# Altium schematic sheet ADC Board TOP.SchDoc
size A3; Author: Jean Callus; Organization: RATON; Revision: 0; SheetNumber: 1
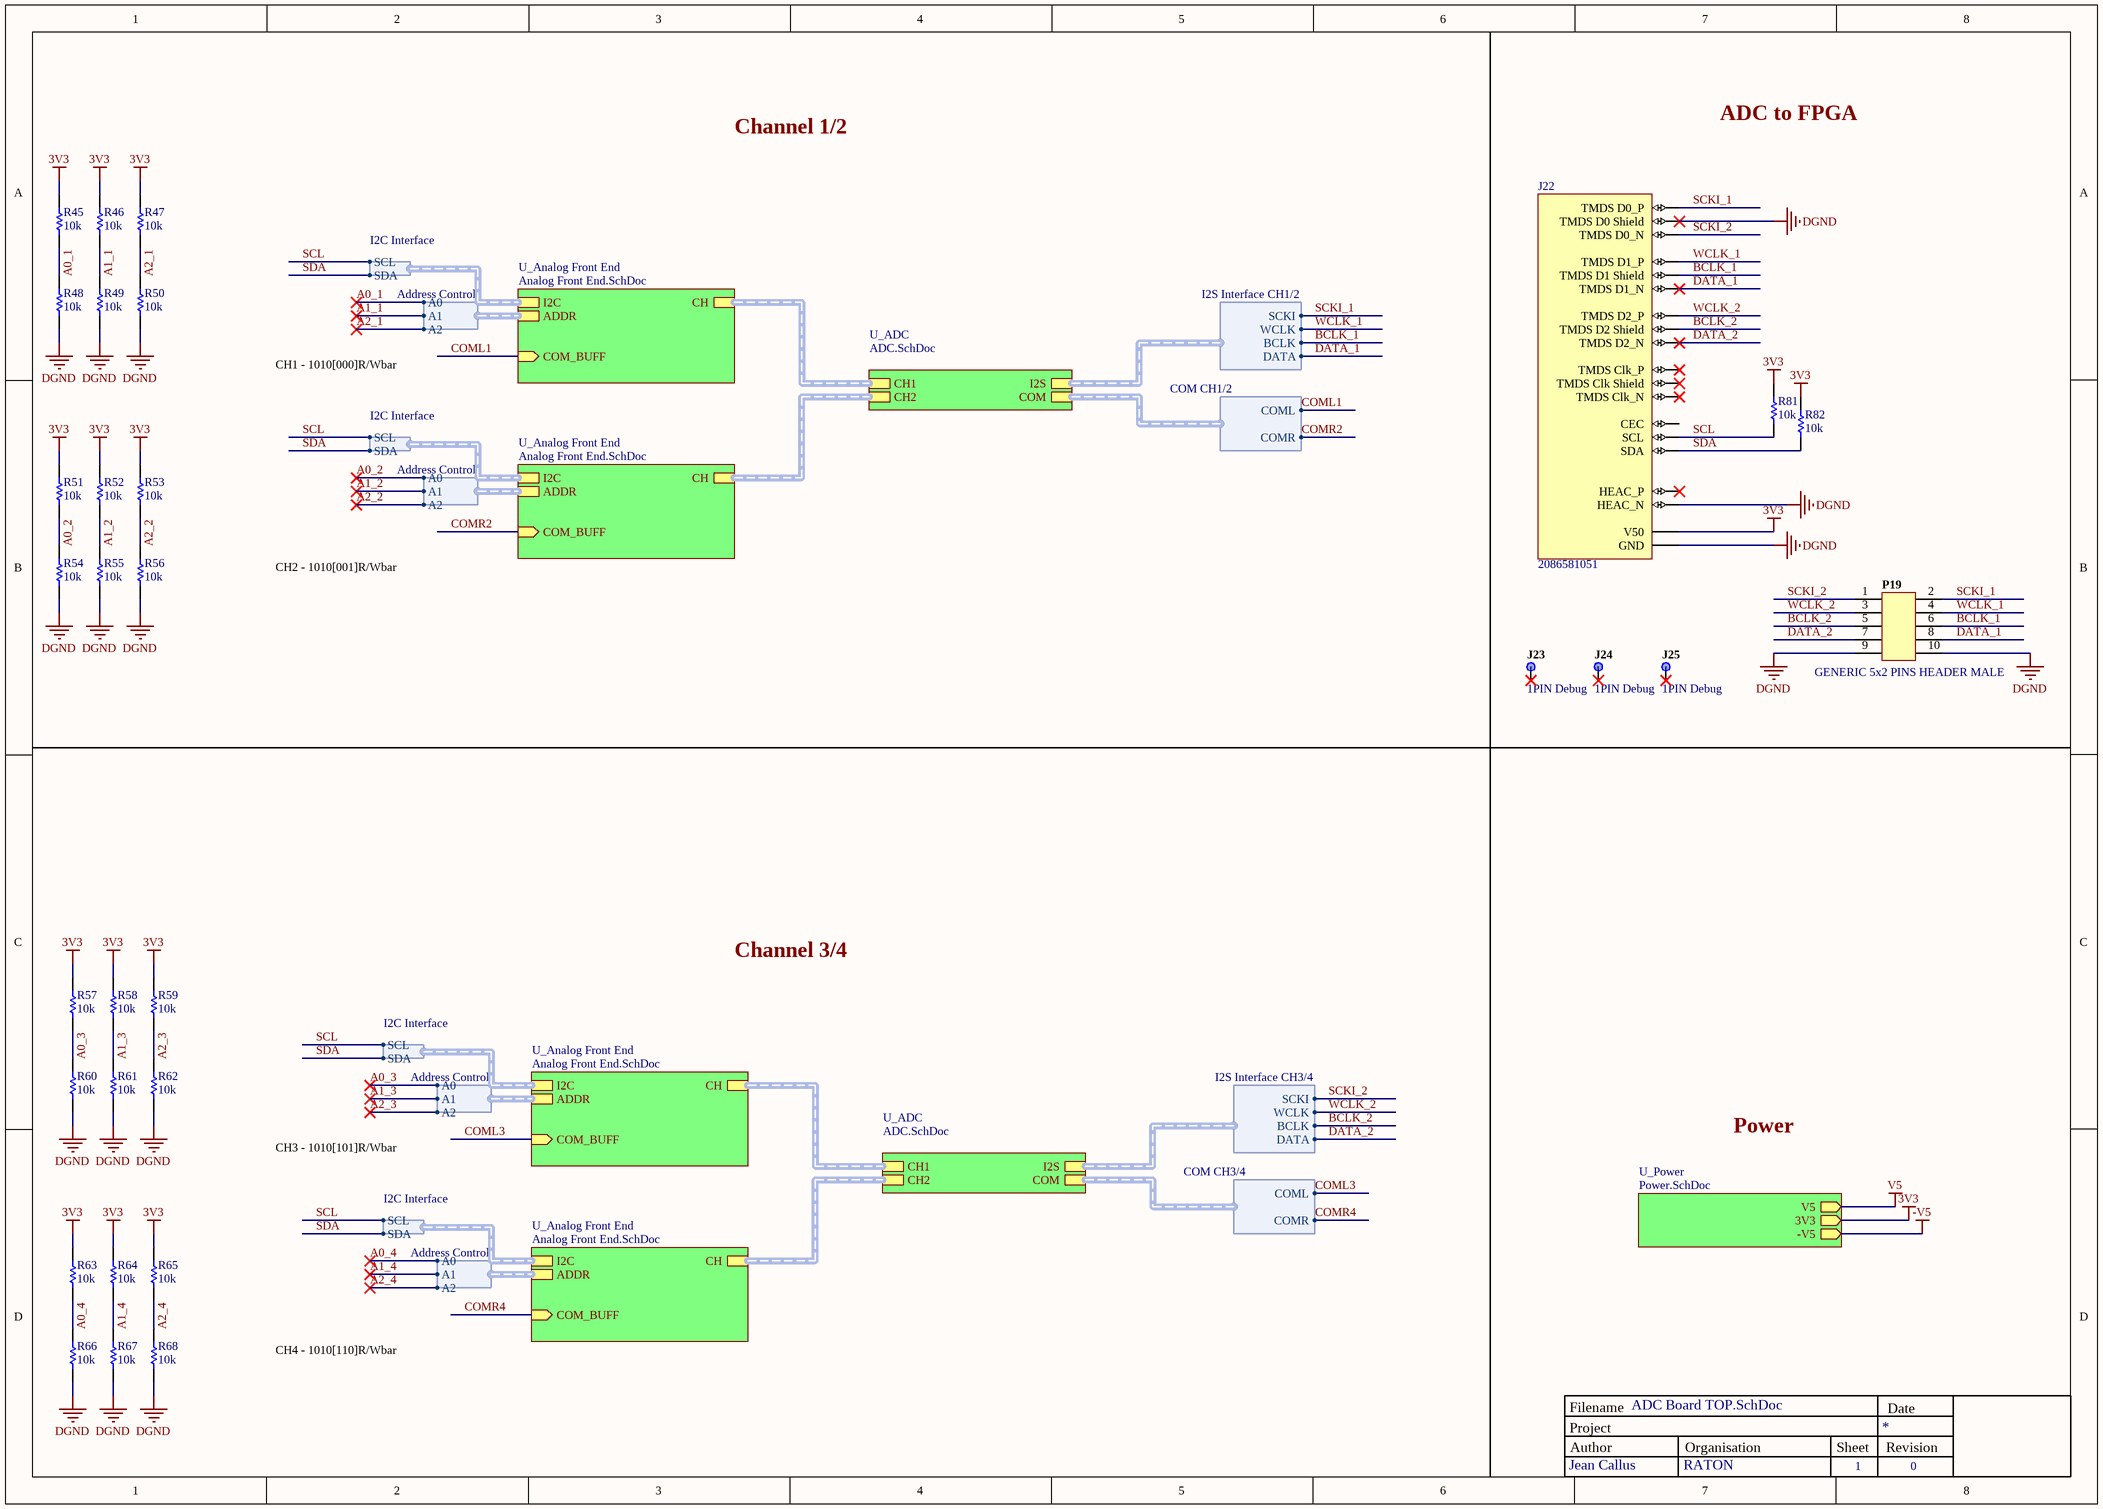
[diagram p0: ADC Board TOP.SchDoc]

## Parts
J22  2086581051  [2086581051]
J23  1PIN Debug  [1 Pin Debug Port 0.9mm]
J24  1PIN Debug  [1 Pin Debug Port 0.9mm]
J25  1PIN Debug  [1 Pin Debug Port 0.9mm]
P19  GENERIC 5x2 PINS HEADER MALE  [GENERIC 5PIN 2ROW HEADER 0]
R45  value 10k  [0402-M]  (hidden comment: RES 10k 0402 63mW 5%)
R46  value 10k  [0402-M]  (hidden comment: RES 10k 0402 63mW 5%)
R47  value 10k  [0402-M]  (hidden comment: RES 10k 0402 63mW 5%)
R48  value 10k  [0402-M]  (hidden comment: RES 10k 0402 63mW 5%)
R49  value 10k  [0402-M]  (hidden comment: RES 10k 0402 63mW 5%)
R50  value 10k  [0402-M]  (hidden comment: RES 10k 0402 63mW 5%)
R51  value 10k  [0402-M]  (hidden comment: RES 10k 0402 63mW 5%)
R52  value 10k  [0402-M]  (hidden comment: RES 10k 0402 63mW 5%)
R53  value 10k  [0402-M]  (hidden comment: RES 10k 0402 63mW 5%)
R54  value 10k  [0402-M]  (hidden comment: RES 10k 0402 63mW 5%)
R55  value 10k  [0402-M]  (hidden comment: RES 10k 0402 63mW 5%)
R56  value 10k  [0402-M]  (hidden comment: RES 10k 0402 63mW 5%)
R57  value 10k  [0402-M]  (hidden comment: RES 10k 0402 63mW 5%)
R58  value 10k  [0402-M]  (hidden comment: RES 10k 0402 63mW 5%)
R59  value 10k  [0402-M]  (hidden comment: RES 10k 0402 63mW 5%)
R60  value 10k  [0402-M]  (hidden comment: RES 10k 0402 63mW 5%)
R61  value 10k  [0402-M]  (hidden comment: RES 10k 0402 63mW 5%)
R62  value 10k  [0402-M]  (hidden comment: RES 10k 0402 63mW 5%)
R63  value 10k  [0402-M]  (hidden comment: RES 10k 0402 63mW 5%)
R64  value 10k  [0402-M]  (hidden comment: RES 10k 0402 63mW 5%)
R65  value 10k  [0402-M]  (hidden comment: RES 10k 0402 63mW 5%)
R66  value 10k  [0402-M]  (hidden comment: RES 10k 0402 63mW 5%)
R67  value 10k  [0402-M]  (hidden comment: RES 10k 0402 63mW 5%)
R68  value 10k  [0402-M]  (hidden comment: RES 10k 0402 63mW 5%)
R81  value 10k  [0402-M]  (hidden comment: RES 10k 0402 63mW 5%)
R82  value 10k  [0402-M]  (hidden comment: RES 10k 0402 63mW 5%)

## Sub-sheets
U_ADC = ADC.SchDoc: I2S (harness I2S Interface CH1/2), CH1 (harness *), CH2 (harness *), COM (harness COM CH1/2)
U_ADC = ADC.SchDoc: I2S (harness I2S Interface CH3/4), CH1 (harness *), CH2 (harness *), COM (harness COM CH3/4)
U_Analog Front End = Analog Front End.SchDoc: COM_BUFF (in), CH (harness *), ADDR (harness Address Control), I2C (harness I2C Interface)
U_Analog Front End = Analog Front End.SchDoc: COM_BUFF (in), CH (harness *), ADDR (harness Address Control), I2C (harness I2C Interface)
U_Analog Front End = Analog Front End.SchDoc: COM_BUFF (in), CH (harness *), ADDR (harness Address Control), I2C (harness I2C Interface)
U_Analog Front End = Analog Front End.SchDoc: COM_BUFF (in), CH (harness *), ADDR (harness Address Control), I2C (harness I2C Interface)
U_Power = Power.SchDoc: V5 (out), 3V3 (out), -V5 (out)

## Harnesses
COM CH1/2: COML, COMR
COM CH3/4: COML, COMR
Address Control: A0, A1, A2
I2C Interface: SCL, SDA
I2S Interface CH1/2: SCKI, WCLK, BCLK, DATA
I2S Interface CH3/4: SCKI, WCLK, BCLK, DATA

## Nets
3V3: J22.18(V50) R45.2 R46.2 R47.2 R51.2 R52.2 R53.2 R57.2 R58.2 R59.2 R63.2 R64.2 R65.2 R81.2 R82.2 ; sheet U_Power/3V3
-V5: sheet U_Power/-V5
DGND: J22.8(TMDS_D0_Shield) J22.17(GND) J22.19(HEAC_N) P19.9 P19.10 R48.1 R49.1 R50.1 R54.1 R55.1 R56.1 R60.1 R61.1 R62.1 R66.1 R67.1 R68.1
V5: sheet U_Power/V5
A0_1: R45.1 R48.2 ; sheet U_Analog Front End/ADDR.A0
A0_2: R51.1 R54.2 ; sheet U_Analog Front End/ADDR.A0
A0_3: R57.1 R60.2 ; sheet U_Analog Front End/ADDR.A0
A0_4: R63.1 R66.2 ; sheet U_Analog Front End/ADDR.A0
A1_1: R46.1 R49.2 ; sheet U_Analog Front End/ADDR.A1
A1_2: R52.1 R55.2 ; sheet U_Analog Front End/ADDR.A1
A1_3: R58.1 R61.2 ; sheet U_Analog Front End/ADDR.A1
A1_4: R64.1 R67.2 ; sheet U_Analog Front End/ADDR.A1
A2_1: R47.1 R50.2 ; sheet U_Analog Front End/ADDR.A2
A2_2: R53.1 R56.2 ; sheet U_Analog Front End/ADDR.A2
A2_3: R59.1 R62.2 ; sheet U_Analog Front End/ADDR.A2
A2_4: R65.1 R68.2 ; sheet U_Analog Front End/ADDR.A2
BCLK_1: J22.5(TMDS_D1_Shield) P19.6 ; sheet U_ADC/I2S.BCLK
BCLK_2: J22.2(TMDS_D2_Shield) P19.5 ; sheet U_ADC/I2S.BCLK
COML1: sheet U_Analog Front End/COM_BUFF, sheet U_ADC/COM.COML
COML3: sheet U_Analog Front End/COM_BUFF, sheet U_ADC/COM.COML
COMR2: sheet U_Analog Front End/COM_BUFF, sheet U_ADC/COM.COMR
COMR4: sheet U_Analog Front End/COM_BUFF, sheet U_ADC/COM.COMR
DATA_1: J22.6(TMDS_D1_N) P19.8 ; sheet U_ADC/I2S.DATA
DATA_2: J22.3(TMDS_D2_N) P19.7 ; sheet U_ADC/I2S.DATA
SCKI_1: J22.7(TMDS_D0_P) P19.2 ; sheet U_ADC/I2S.SCKI
SCKI_2: J22.9(TMDS_D0_N) P19.1 ; sheet U_ADC/I2S.SCKI
SCL: J22.15(SCL) R81.1 ; sheet U_Analog Front End/I2C.SCL
SDA: J22.16(SDA) R82.1 ; sheet U_Analog Front End/I2C.SDA
WCLK_1: J22.4(TMDS_D1_P) P19.4 ; sheet U_ADC/I2S.WCLK
WCLK_2: J22.1(TMDS_D2_P) P19.3 ; sheet U_ADC/I2S.WCLK

Not connected (* = marked no-connect by the designer): J22 10(TMDS_Clk_P)* 11(TMDS_Clk_Shield)* 12(TMDS_Clk_N)* 13(CEC) 14(HEAC_P)*; J23 1*; J24 1*; J25 1*

## Buses and harness runs
harness sheet U_ADC/CH1 = sheet U_Analog Front End/CH
harness sheet U_ADC/CH2 = sheet U_Analog Front End/CH

## Notes on the sheet
- Channel 1/2
- ADC to FPGA
- CH1 - 1010[000]R/Wbar
- CH2 - 1010[001]R/Wbar
- Channel 3/4
- CH3 - 1010[101]R/Wbar
- Power
- CH4 - 1010[110]R/Wbar
- Project
- Filename
- Author
- Organisation
- Sheet
- Revision
- Date
  Date

## Library data of the parts
J22 = 2086581051-2: CONN FEM SMD 19 90Deg HDMI; Manufacturer: Molex; Status: Active; Supplier 1: Mouser; Source: Connector Library.SchLib; Design Item ID: 2086581051; Bin: *; Supplier Part Number 1: Mouser; Type: HYBRID; Case/Package: 4 PIN
J23-J25 = 1PIN Debug-2: CONN MAL TH 1 0Deg HEADER; Status: NC; Case/Package: 1 PIN; Source: Connector Library.SchLib; Type: N/A; Design Item ID: 1PIN Debug
P19 = GENERIC 5x2 PINS HEADER MALE-2: CONN MAL TH 5x2 0Deg HEADER; Bin: B3-J5; Status: Active; Case/Package: 2 PIN; Source: Connector Library.SchLib; Type: TH; Design Item ID: GENERIC 5x2 PINS HEADER MALE; Manufacturer: Generic
R45-R68 R81 R82 = RES 10k 0402 63mW 5%-1: RES-10k-0402-63mW-5%; Manufacturer: Generic; Bin: F1-R7-9; MAPPING: 1(2,1,11.5k); Design Item ID: RES 10k 0402 63mW 5%; Type: SMD; Status: Active; Case/Package: 0402; Source: Resistor Library.SchLib